# EAGLE design MK12_PIR_LUX (EAGLE 9.0.1)

## Sheet 1 of 2
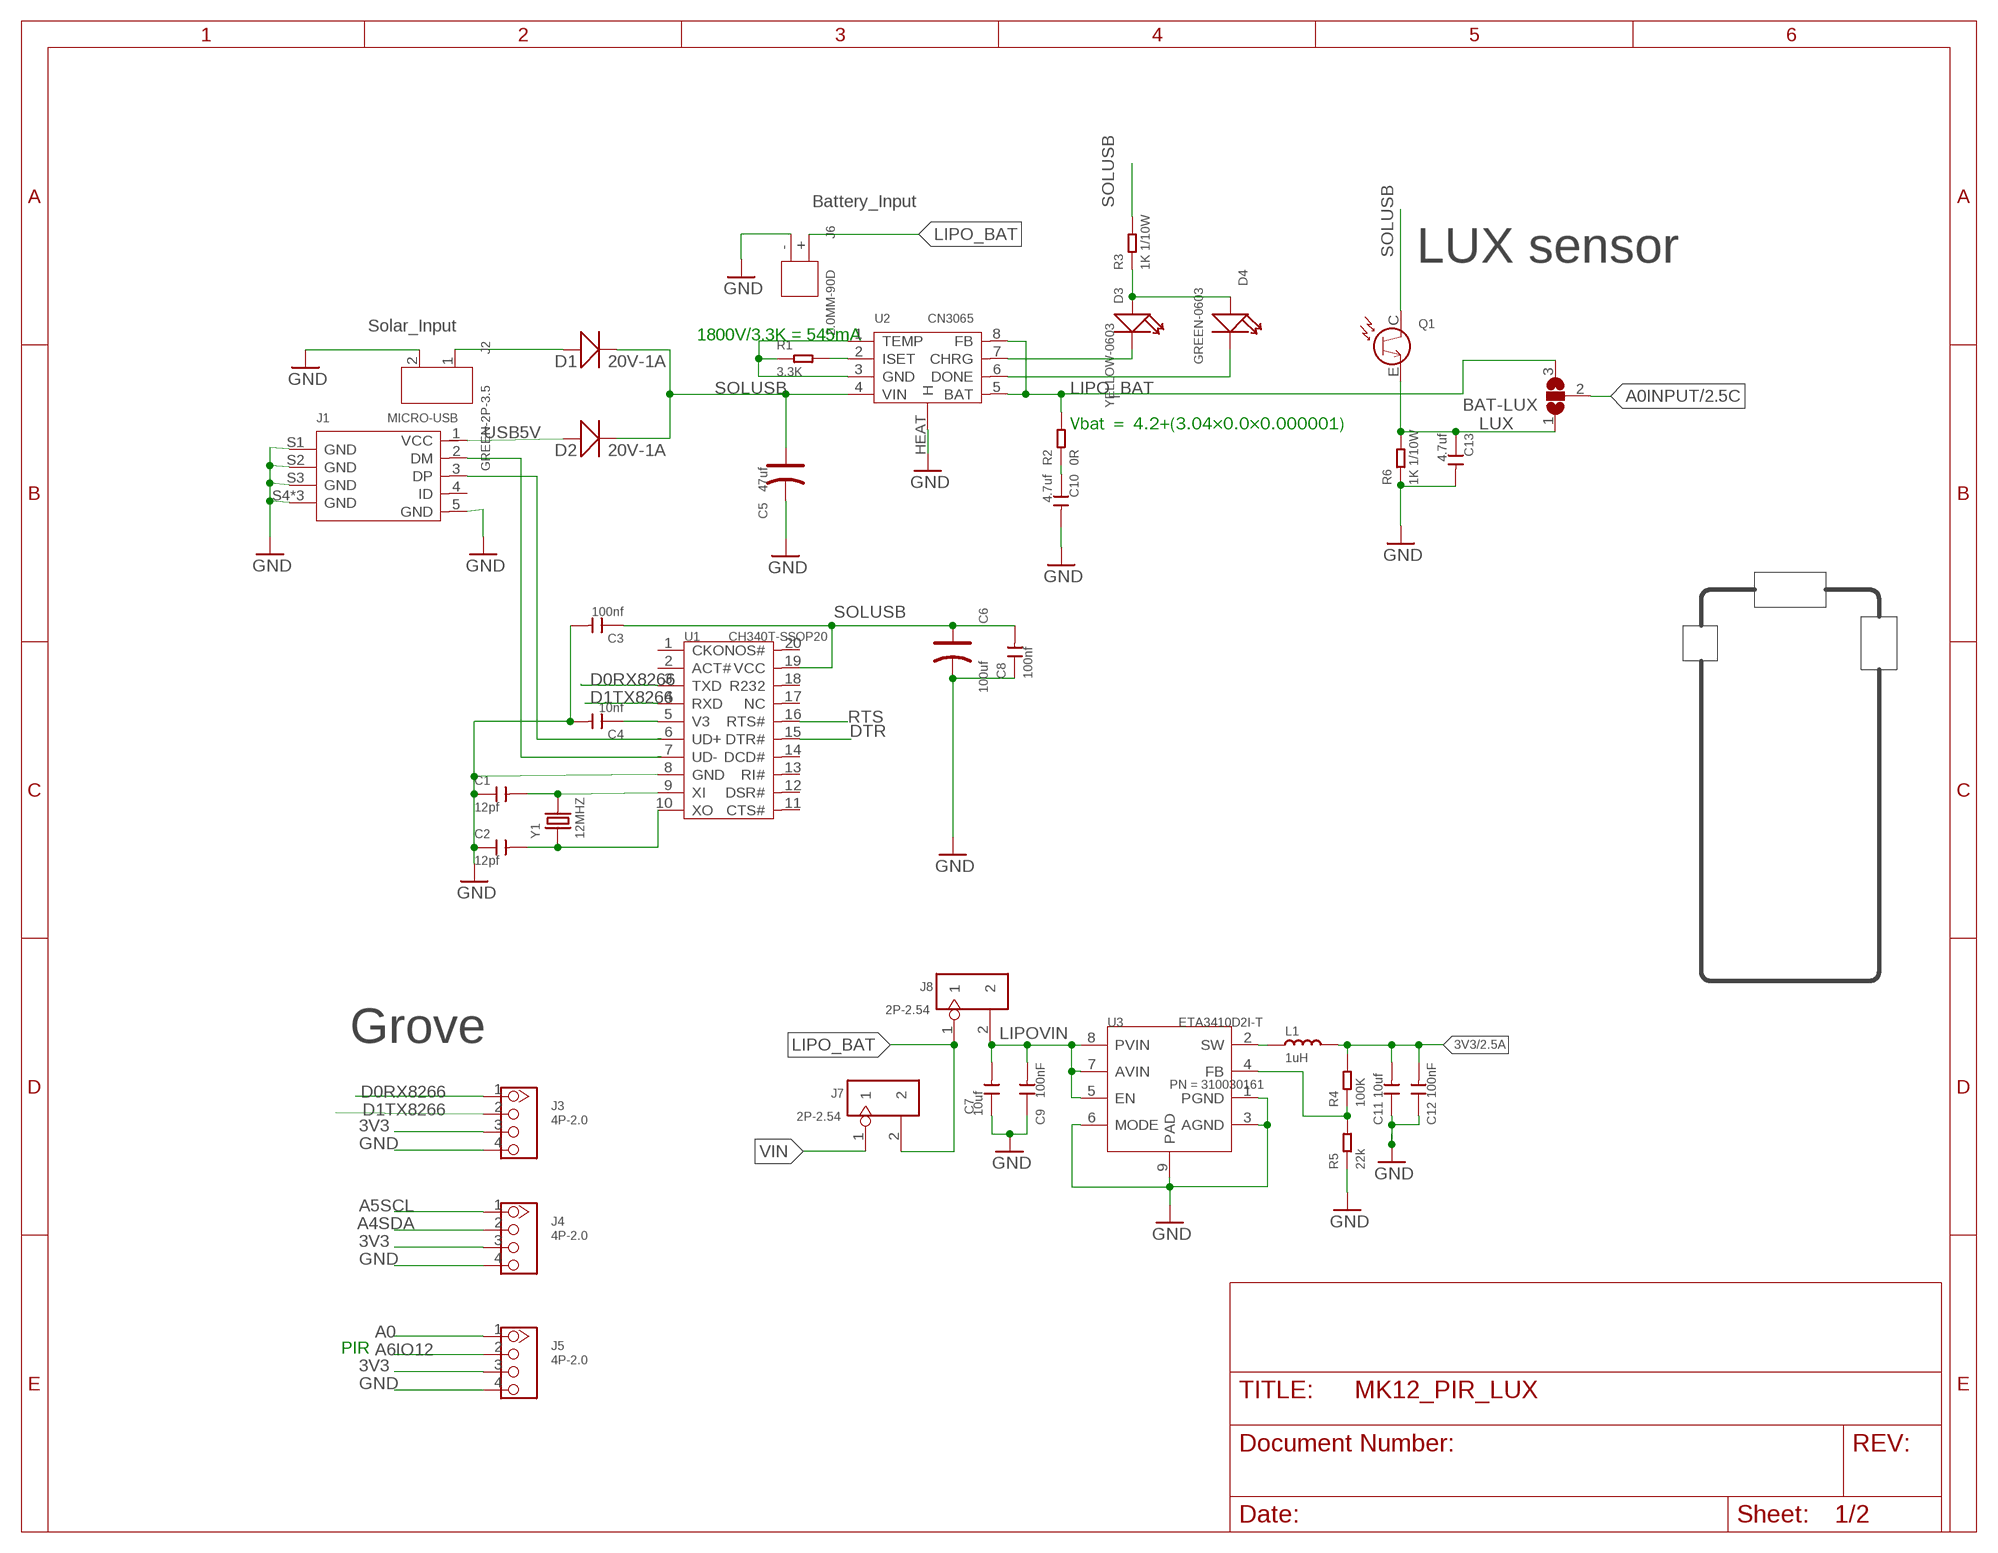
[diagram p0: schematic, sheet 1]

### Parts
BAT-LUX  SJ2W  [SJ_2]
C1  12pf  CERAMIC-12PF-50V-5%-NPO(0402)  [C0402]
C2  12pf  CERAMIC-12PF-50V-5%-NPO(0402)  [C0402]
C3  100nf  CERAMIC-100NF-50V-10%-X7R(0603)  [C0603]
C4  10nf  CERAMIC-10NF-50V-10%-X7R(0603)  [C0603]
C5  47uf  TANTALUM-SMD-47UF-6.3V(AVX-A)  [AVX-A]
C6  100uf  TANTALUM-SMD-100UF-10V(AVX-B)  [AVX-B]
C7  10uf  CERAMIC-10UF-25V-10%-X5R(0805)  [C0805]
C8  100nf  CERAMIC-100NF-50V-10%-X7R(0603)  [C0603]
C9  100nF  CAP-0402  [C0402]
C10  4.7uf  CERAMIC-4.7UF-10V-10%-X5R(0603)  [C0603]
C11  10uf  CERAMIC-10UF-25V-10%-X5R(0805)  [C0805]
C12  100nF  CAP-0402  [C0402]
C13  4.7uf  CERAMIC-4.7UF-10V-10%-X5R(0603)  [C0603]
D1  20V-1A  SMD-DIODE-SCHOTTKY-20V-1A(SOD-123)  [SOD-123]
D2  20V-1A  SMD-DIODE-SCHOTTKY-20V-1A(SOD-123)  [SOD-123]
D3  YELLOW-0603  SMD-LED-CLEAR-YELLOW(0603)  [LED-0603]
D4  GREEN-0603  SMD-LED-CLEAR-GREEN(0603)  [LED-0603]
J1  MICRO-USB  MICRO-USB5+4P'5+4P'  [MICRO-USB5+4P-SMD-0.65-B]
J2  GREEN-2P-3.5  SCREW-TERMINAL-GREEN(2P-3.5)  [H2-3.5-7.0X7.0MM]
J3  4P-2.0  GROVE-CONNECTOR-DIP(4P-2.0)  [HW4-2.0]
J4  4P-2.0  GROVE-CONNECTOR-DIP(4P-2.0)  [HW4-2.0]
J5  4P-2.0  GROVE-CONNECTOR-DIP(4P-2.0)  [HW4-2.0]
J6  2.0MM-90D  CONN-HEADER-PH-SIDE-(2P-2.0MM)'90D'  [H2-2.0-90D]
J7  2P-2.54  DIP-WHITE-MALE-HEADER-VERT(2P-2.54)  [H2-2.54]
J8  2P-2.54  DIP-WHITE-MALE-HEADER-VERT(2P-2.54)  [H2-2.54]
L1  1uH  INDUCTOR/FERRITE-BEAD'0603'  [L0603]
Q1  EAALST05RDMA0  [EAALST05RDMA0]
R1  3.3K  SMD-RES-3.3K-5%-1/10W(0603)  [R0603]
R2  0R  SMD-RES-0R-5%-1/10W(0603)  [R0603]
R3  1K 1/10W  SMD-RES-1K-5%-1/10W(0603)  [R0603]
R4  100K  SMD-RES-100K-1%-1/16W(0402)  [R0402]
R5  22k  SMD-RES-22K-1%-1/16W(0402)  [R0402]
R6  1K 1/10W  SMD-RES-1K-5%-1/10W(0603)  [R0603]
U1  CH340T-SSOP20  INTERFACE-CH340T(SSOP20)  [SSOP20-0.65-7.6X5.2MM]
U2  CN3065  PMIC-CN3065-DFN8  [DFN-8]
U3  ETA3410D2I-T  CONVERTER-ETA3410  [DFN8G-0.5-2X2MM]
Y1  12MHZ  SMD-CRYSTAL-12MHZ-20PF-20PPM-40R(2P-5.0X3.2MM)  [X2-SMD-5.0X3.2X1.3MM]

### Nets
3V3 [POWER]: C11.2 C12.2 J3.3 J4.3 J5.3 L1.2 R4.2 ; also sheet 2
A0: J5.1 ; also sheet 2
A0INPUT [POWER]: BAT-LUX.2 ; also sheet 2
A4SDA: J4.2 ; also sheet 2
A5SCL: J4.1 ; also sheet 2
A6IO12: J5.2 ; also sheet 2
D0RX8266: J3.1 U1.3(TXD) ; also sheet 2
D1TX8266: J3.2 U1.4(RXD) ; also sheet 2
DTR: U1.15(DTR#) ; also sheet 2
GND [POWER]: C1.1 C2.1 C3.2 C4.2 C5.- C6.- C7.1 C8.1 C9.1 C10.2 C11.1 C12.1 C13.2 J1.5(GND) J1.S1(GND) J1.S2(GND) J1.S3(GND) J1.S4(GND) J1.S5(GND) J1.S6(GND) J2.2 J3.4 J4.4 J5.4 J6.- R1.1 R5.1 R6.1 U1.8(GND) U2.1(TEMP) U2.3(GND) U2.HEAT(H) U3.1(PGND) U3.3(AGND) U3.6(MODE) U3.9(PAD) ; also sheet 2
LIPO_BAT [POWER]: BAT-LUX.3 J6.+ J7.2 J8.1 R2.2 U2.5(BAT) U2.8(FB)
LIPOVIN: C7.2 C9.2 J8.2 U3.5(EN) U3.7(AVIN) U3.8(PVIN)
LUX: BAT-LUX.1 C13.1 Q1.E R6.2
N$2: D3.+ D4.+ R3.1
N$3: L1.1 U3.2(SW)
N$4: R4.1 R5.2 U3.4(FB)
N$5 [POWER]: C1.2 U1.9(XI) Y1.2
N$6 [POWER]: C2.2 U1.10(XO) Y1.1
N$7: R1.2 U2.2(ISET)
N$8: D3.- U2.7(CHRG)
N$9: J1.2(DM) U1.7(UD-)
N$10: C10.1 R2.1
N$11: J1.3(DP) U1.6(UD+)
N$12: D4.- U2.6(DONE)
RTS: U1.16(RTS#) ; also sheet 2
SOLAR [VUSB]: D1.+ J2.1
SOLUSB [POWER]: C3.1 C5.+ C6.+ C8.2 D1.- D2.- Q1.C R3.2 U1.19(VCC) U2.4(VIN)
USB5V [VUSB]: D2.+ J1.1(VCC)
V3: C4.1 U1.5(V3)
VIN [POWER]: J7.1 ; also sheet 2
Unconnected: J1.4(ID) U1.1(CKO) U1.2(ACT#) U1.11(CTS#) U1.12(DSR#) U1.13(RI#) U1.14(DCD#) U1.17(NC) U1.18(R232) U1.20(NOS#)

### Notes on the sheet
- Battery_Input
- LUX sensor
- Solar_Input
- 1800V/3.3K = 545mA
- Vbat ＝ 4.2+(3.04×0.0×0.000001)
- Grove
- PIR

## Sheet 2 of 2
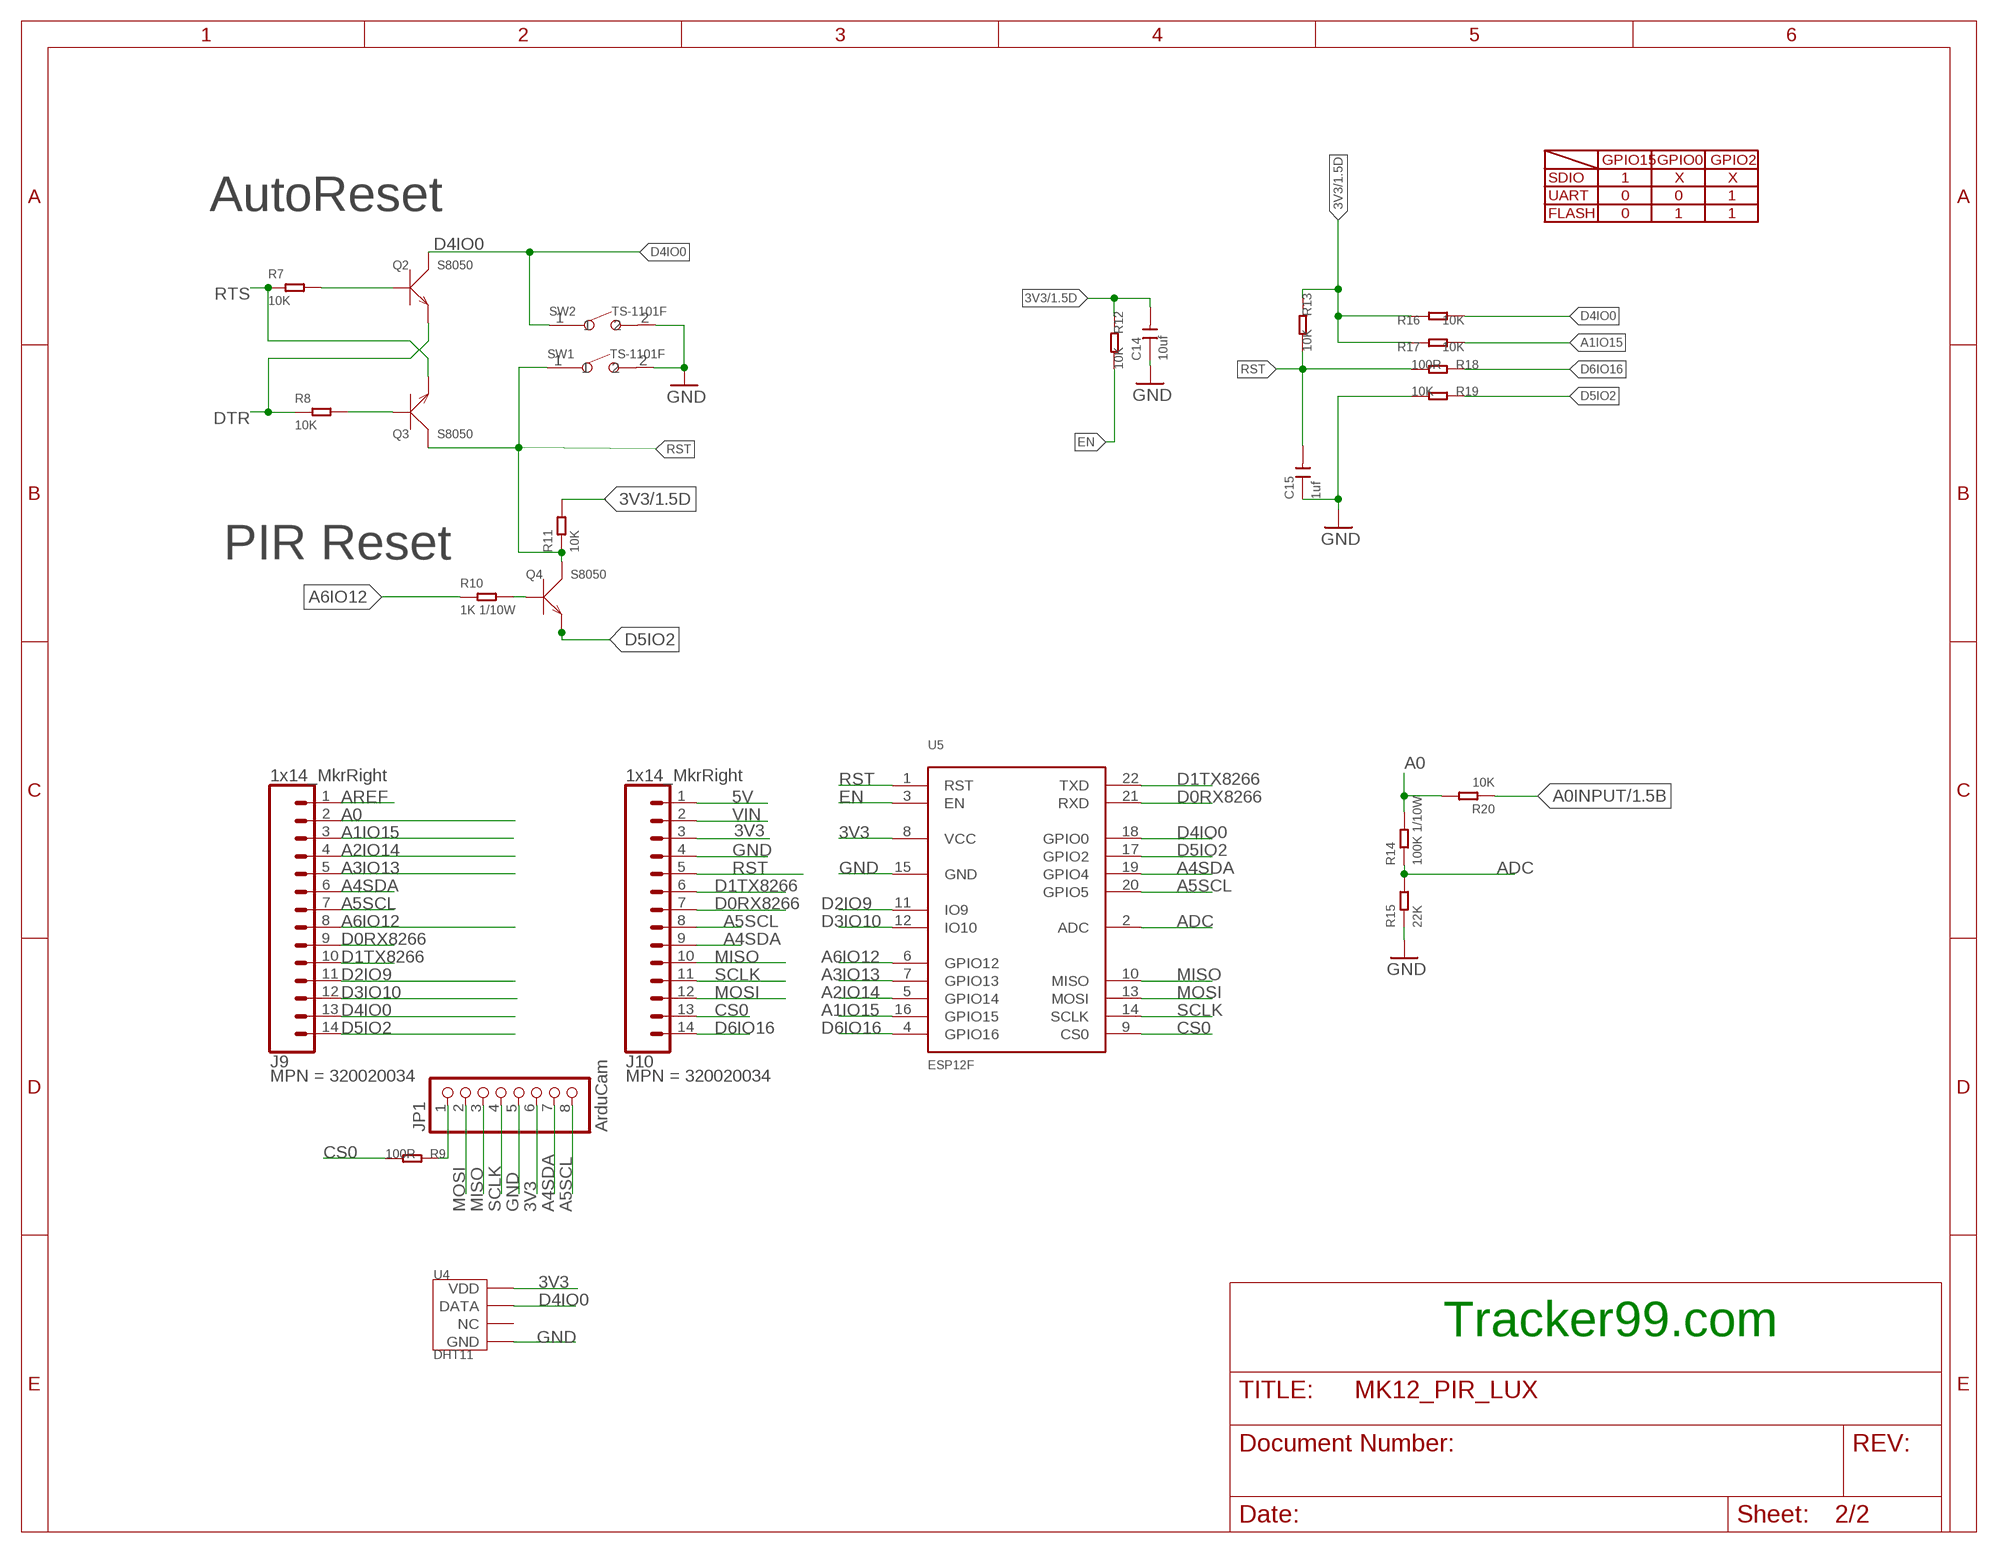
[diagram p1: schematic, sheet 2]

### Parts
C14  10uf  CERAMIC-10UF-10V-10%-X5R(0603)  [C0603]
C15  1uf  CERAMIC-1UF-25V-10%-X7R(0603)  [C0603]
J9  1x14_MkrRight  CONN_14LOCK  [1X14_LOCK]
J10  1x14_MkrRight  CONN_14LOCK  [1X14_LOCK]
JP1  ArduCam  MILLER_PINHD-1X8LOCK  [MILLER_1X08-LOCK]
Q2  S8050  SMD-TRANSISTORS-NPN-25V-500MW-S8050(SOT-23)  [SOT-23]
Q3  S8050  SMD-TRANSISTORS-NPN-25V-500MW-S8050(SOT-23)  [SOT-23]
Q4  S8050  SMD-TRANSISTORS-NPN-25V-500MW-S8050(SOT-23)  [SOT-23]
R7  10K  SMD-RES-10K-5%-1/(0402)  [R0402]
R8  10K  SMD-RES-10K-5%-1/(0402)  [R0402]
R9  100R  SMD-RES-100R-5%-1/10W(0603)  [R0603]
R10  1K 1/10W  SMD-RES-1K-5%-1/10W(0603)  [R0603]
R11  10K  SMD-RES-10K-5%-1/(0402)  [R0402]
R12  10K  SEEED-RESISTOR_SMD-RES-10K-5%-1/(0402)  [SEEED-RESISTOR_R0402]
R13  10K  SEEED-RESISTOR_SMD-RES-10K-5%-1/(0402)  [SEEED-RESISTOR_R0402]
R14  100K 1/10W  SMD-RES-100K-5%-1/10W(0603)  [R0603]
R15  22K  SMD-RES-22K-5%-1/10W(0603)  [R0603]
R16  10K  SEEED-RESISTOR_SMD-RES-10K-5%-1/(0402)  [SEEED-RESISTOR_R0402]
R17  10K  SEEED-RESISTOR_SMD-RES-10K-5%-1/(0402)  [SEEED-RESISTOR_R0402]
R18  100R  SMD-RES-100R-5%-1/10W(0603)  [R0603]
R19  10K  SEEED-RESISTOR_SMD-RES-10K-5%-1/(0402)  [SEEED-RESISTOR_R0402]
R20  10K  SMD-RES-10K-5%-1/(0402)  [R0402]
SW1  TS-1101F  DIP-BUTTON(2P-6.0X3.0X4.3MM)-TS-1101F  [SW2-5.0-6.0X3.0X4.3MM]
SW2  TS-1101F  DIP-BUTTON(2P-6.0X3.0X4.3MM)-TS-1101F  [SW2-5.0-6.0X3.0X4.3MM]
U4  DHT11  TEM-HUM-DHT11(4P-15.5X12.0MM)  [SNR4-2.54-15.5X12.0X5.5MM]
U5  ESP12F  ESP-12F  [ESP-12F]

### Nets
3V3 [POWER]: C14.2 J10.3 JP1.6 R11.2 R12.1 R13.1 R16.1 R17.1 U4.1(VDD) U5.8(VCC) ; also sheet 1
5V [POWER]: J10.1
A0: J9.2 R14.2 R20.2 ; also sheet 1
A0INPUT [POWER]: R20.1 ; also sheet 1
A1IO15: J9.3 R17.2 U5.16(GPIO15)
A2IO14: J9.4 U5.5(GPIO14)
A3IO13: J9.5 U5.7(GPIO13)
A4SDA: J9.6 J10.9 JP1.7 U5.19(GPIO4) ; also sheet 1
A5SCL: J9.7 J10.8 JP1.8 U5.20(GPIO5) ; also sheet 1
A6IO12: J9.8 R10.1 U5.6(GPIO12) ; also sheet 1
ADC: R14.1 R15.2 U5.2(ADC)
AREF: J9.1
CS0: J10.13 R9.2 U5.9(CS0)
D0RX8266: J9.9 J10.7 U5.21(RXD) ; also sheet 1
D1TX8266: J9.10 J10.6 U5.22(TXD) ; also sheet 1
D2IO9: J9.11 U5.11(IO9)
D3IO10: J9.12 U5.12(IO10)
D4IO0: J9.13 Q2.3(C) R16.2 SW2.1 U4.2(DATA) U5.18(GPIO0)
D5IO2: J9.14 Q4.2(E) R19.1 U5.17(GPIO2)
D6IO16: J10.14 R18.1 U5.4(GPIO16)
DTR: Q2.2(E) R8.1 ; also sheet 1
EN: R12.2 U5.3(EN)
GND [POWER]: C14.1 C15.1 J10.4 JP1.5 R15.1 R19.2 SW1.2 SW2.2 U4.4(GND) U5.15(GND) ; also sheet 1
MISO: J10.10 JP1.3 U5.10(MISO)
MOSI: J10.12 JP1.2 U5.13(MOSI)
N$1: Q4.1(B) R10.2
N$13: JP1.1 R9.1
N$14: Q3.1(B) R8.2
N$15: Q2.1(B) R7.2
N$20: Q4.3(C) R11.1
RST: C15.2 J10.5 Q3.3(C) R13.2 R18.2 SW1.1 U5.1(RST)
RTS: Q3.2(E) R7.1 ; also sheet 1
SCLK: J10.11 JP1.4 U5.14(SCLK)
VIN [POWER]: J10.2 ; also sheet 1
Unconnected: U4.3(NC)

### Notes on the sheet
- GPIO15 | GPIO0 | GPIO2
- SDIO | 1 | X | X
- UART | 0 | 0 | 1
- AutoReset
- FLASH | 0 | 1 | 1
- PIR Reset
- Tracker99.com

## Library data of the parts
BAT-LUX = jumper:SJ2W: SMD solder JUMPER
C1 C2 = Seeed-Capacitor:CERAMIC-12PF-50V-5%-NPO(0402): 302010049; MPN: CC0402JRNPO9BN120
C3 C8 = Seeed-Capacitor:CERAMIC-100NF-50V-10%-X7R(0603): 302010138; MPN: CC0603KRX7R9BB104
C4 = Seeed-Capacitor:CERAMIC-10NF-50V-10%-X7R(0603): 302010140; MPN: CC0603KRX7R9BB103
C5 = Seeed-Capacitor:TANTALUM-SMD-47UF-6.3V(AVX-A): 302020005; MPN: TAJA476*006#NJ
C6 = Seeed-Capacitor:TANTALUM-SMD-100UF-10V(AVX-B): 302020015; MPN: TAJB107M010#NJ
C7 C11 = Seeed-Capacitor:CERAMIC-10UF-25V-10%-X5R(0805): 302010178; MPN: CC0805KKX5R8BB106; PN: 302010178
C9 C12 = Discrete-new:CAP: Ceramic Capacitors; PN: 302010004
C10 C13 = Seeed-Capacitor:CERAMIC-4.7UF-10V-10%-X5R(0603): 302010111; MPN: CC0603KRX5R6BB475
C14 = Seeed-Capacitor:CERAMIC-10UF-10V-10%-X5R(0603): 302010103; MPN: CC0603KRX5R6BB106
C15 = Seeed-Capacitor:CERAMIC-1UF-25V-10%-X7R(0603): 302010139; MPN: CC0603KRX7R8BB105
D1 D2 = Seeed-OPL-2017-01-Diode-james:SMD-DIODE-SCHOTTKY-20V-1A(SOD-123): 304020034; MPN: B5819W
D3 = Seeed-LED:SMD-LED-CLEAR-YELLOW(0603): 304090044; MPN: 19-217-Y5C-AM1N1VY-3T
D4 = Seeed-LED:SMD-LED-CLEAR-GREEN(0603): 304090043; MPN: 19-217-G7C-AN1P2-3T
J1 = Connector-new:MICRO-USB5+4P: 5+4P-SMD-0.65-B:320010000;5+2P-SMD-0.65-AB:340032001; EAGLEUP: USB-MICROB;2.54mm
J2 = Seeed-Connector:SCREW-TERMINAL-GREEN(2P-3.5): 320110028
J3-J5 = Seeed-Connector:GROVE-CONNECTOR-DIP(4P-2.0): 320110033
J6 = Seeed-Connector:CONN-HEADER-PH-SIDE-(2P-2.0MM): 320110027
J7 J8 = Seeed-Connector:DIP-WHITE-MALE-HEADER-VERT(2P-2.54): 320020037; MPN: P125-1102A0BS116A3
J9 J10 = SparkFun-Connectors:CONN_14: Multi connection point. Often used as Generic Header-pin footprint for 0.1 inch spaced/style header connections On any of the 0.1 inch spaced packages, you can populate with these: Break Away Headers - Straight <https://www.sparkfun.com/products/116> (PRT-00116) Break Away Male Headers - Right Angle <https://www.sparkfun.com/products/553> (PRT-00553) Female Headers <https://www.sparkfun.com/products/115> (PRT-00115) Break Away Headers - Machine Pin <https://www.sparkfun.com/products/117> (PRT-00117) Break Away Female Headers - Swiss Machine Pin <https://www.sparkfun.com/products/743> (PRT-00743) For SCREWTERMINALS and SPRING TERMINALS visit here: Screw Terimnals on SparkFun.com <https://www.sparkfun.com/search/results?term=Screw+Terminals> (5mm/3.5mm/2.54mm spacing) This device is also useful as a general connection point to wire up your design to another part of your project. Our various solder wires solder well into these plated through hole pads. Hook-Up Wire - Assortment (Stranded, 22 AWG) <https://www.sparkfun.com/products/11375> (PRT-11375) Hook-Up Wire - Assortment (Solid Core, 22 AWG) <https://www.sparkfun.com/products/11367> (PRT-11367) View the entire wire category on our website here <https://www.sparkfun.com/categories/141> Special notes: Molex polarized connector foot print use with SKU : PRT-08231 with associated crimp pins and housings. 1MM SMD Version SKU: PRT-10208 NOTES ON THE VARIANTS LOCK and LOCK_LONGPADS... This footprint was designed to help hold the alignment of a through-hole component (i.e. 6-pin header) while soldering it into place. You may notice that each hole has been shifted either up or down by 0.005 of an inch from it's more standard position (which is a perfectly straight line). This slight alteration caused the pins (the squares in the middle) to touch the edges of the holes. Because they are alternating, it causes a "brace" to hold the component in place. 0.005 has proven to be the perfect amount of "off-center" position when using our standard breakaway headers. Although looks a little odd when you look at the bare footprint, once you have a header in there, the alteration is very hard to notice. Also,if you push a header all the way into place, it is covered up entirely on the bottom side.; MPN: 320020034
JP1 = MKR12FUNO99:MILLER_PINHD-1X8: PIN HEADER
L1 = Discrete-new:INDUCTOR/FERRITE-BEAD; PN: 303010110
Q1 = Seeed-OPL-2017-01-Sensor-camilo:EAALST05RDMA0: 314020201
Q2-Q4 = Seeed-Transistor:SMD-TRANSISTORS-NPN-25V-500MW-S8050(SOT-23): 305010017; MPN: S8050
R1 = Seeed-Resistor:SMD-RES-3.3K-5%-1/10W(0603): 301010112
R2 = Seeed-Resistor:SMD-RES-0R-5%-1/10W(0603): 301010292; MPN: RC0603JR-070RL
R3 R6 R10 = Seeed-Resistor:SMD-RES-1K-5%-1/10W(0603): 301010291; MPN: RC0603JR-071KL
R4 = Seeed-Resistor:SMD-RES-100K-1%-1/16W(0402): 301010456; MPN: RC0402FR-07100KL; PN: 301010666
R5 = Seeed-Resistor:SMD-RES-22K-1%-1/16W(0402); MPN: RC0402FR-0722KL
R7 R8 R11 R20 = Seeed-Resistor:SMD-RES-10K-5%-1/(0402): 301010004; MPN: RC0402JR-0710KL
R9 R18 = Seeed-Resistor:SMD-RES-100R-5%-1/10W(0603): 301010090; MPN: RC0603JR-07100RL
R12 R13 R16 R17 R19 = R3Mkr12F_Solar:SEEED-RESISTOR_SMD-RES-10K-5%-1/(0402): 301010004; MPN: RC0402JR-0710KL
R14 = Seeed-Resistor:SMD-RES-100K-5%-1/10W(0603): 301010089; MPN: RC0603JR-07100KL; PN: 301010666
R15 = Seeed-Resistor:SMD-RES-22K-5%-1/10W(0603): 301010132; MPN: RC0603JR-0722KL
SW1 SW2 = Seeed-Switch:DIP-BUTTON(2P-6.0X3.0X4.3MM): 311020025; MPN: TS-1101F
U1 = Seeed-IC:INTERFACE-CH340T(SSOP20): 310070026; MPN: CH340T
U2 = IC-new:PMIC-CN3065: 310030101
U3 = template:CONVERTER-ETA3410: 3MHZ 2A High Step-Down Converter in DFN2x2-8L Package; PN: 310030161
U4 = Seeed-Sensor:TEM-HUM-DHT11(4P-15.5X12.0MM): 314010000; MPN: DHT11
U5 = Seeed-OPL-2017-01-Sensor-camilo:ESP-12F: 317060163
Y1 = Seeed-Crystal Oscillator:SMD-CRYSTAL-12MHZ-20PF-20PPM-40R(2P-5.0X3.2MM): 306010047; MPN: 5032/2P

## Net classes
0 default: width 0.152 mm, drill 0.152 mm, clearance 0.152 mm
1 POWER: width 0.305 mm, clearance 0.152 mm
2 VUSB: width 0.305 mm, clearance 0.203 mm

## Board
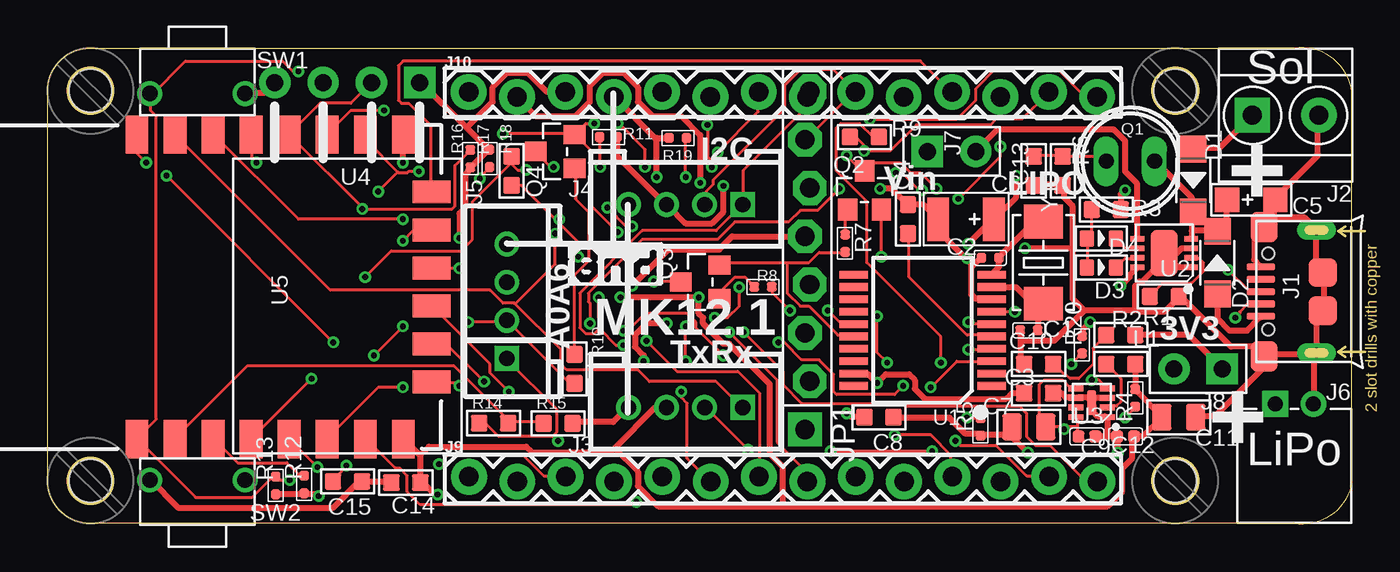
[diagram p2: board, top side]
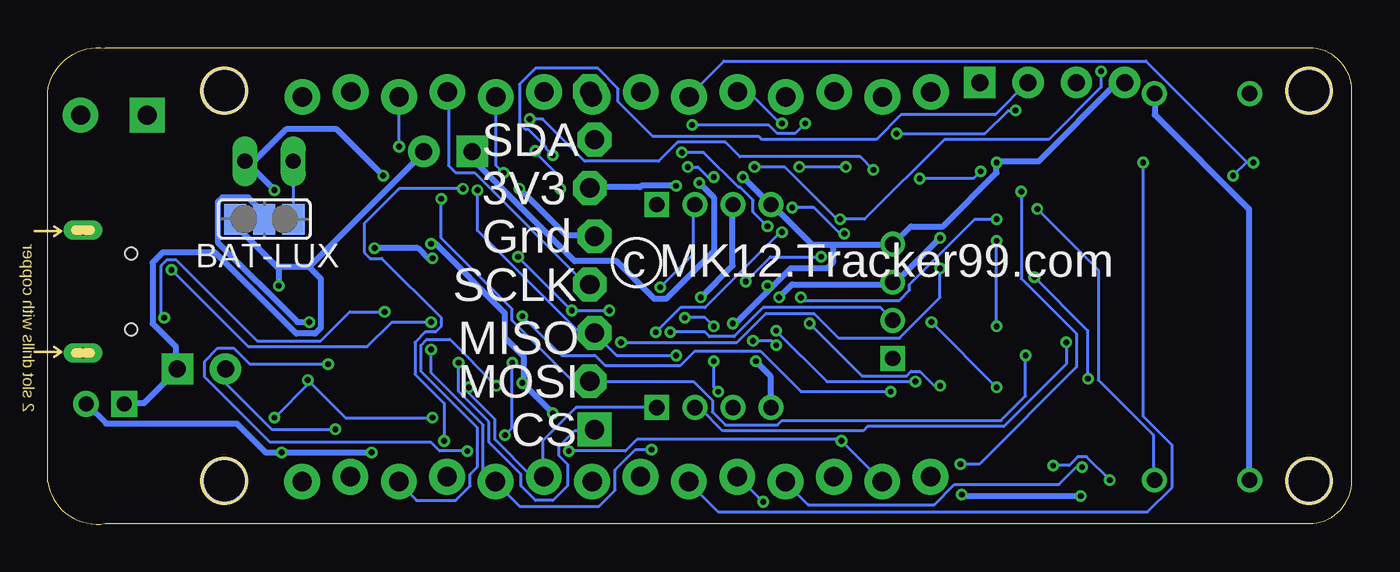
[diagram p3: board, bottom side, seen from below]

Size 68.54 x 25.05 mm. Coordinates in mm from the lower left corner, seen from the top.
Outline: 0,2.28 0,22.78 arc-90 2.25,25.03 65.5,25.03 arc-90 68.54,22.73 68.54,2.23 arc-90 65.5,0.03 2.25,0.03 arc-90 0,2.28
Copper layers (1*16): Top 0.035mm / dielectric 1.5mm / Bottom 0.035mm
Design rules "SeeedStudio_2layer_DRU_no_angle_20140221 *": minimum track width 6mil, minimum drill 12mil, track to track 6mil, track to pad 6mil, pad to pad 6mil, via to via 6mil, smd to smd 0mil, copper to edge 10mil, drill to drill 10mil, minimum pad ring 10mil, minimum via ring 6mil, stop-mask expansion 2mil, vias tented up to drill 100mil, thermal gap 10mil
Holes 2.25 mm at 2.25,2.28 59.25,2.28 59.25,22.78 2.25,22.78
tRestrict: area 0,0.1 to 4.5,4.5; area 0,20.6 to 4.5,25; area 57,20.6 to 61.5,25; area 57,0.1 to 61.5,4.5; area 0,4.4 to 4.1,20.4; area 10.7,24.4 to 57.9,25.4; area 10.2,-0.5 to 57.4,0.5; 26 lines
bRestrict: area 0,0.1 to 4.5,4.5; area 0,20.6 to 4.5,25; area 57,0.1 to 61.5,4.5; area 57,20.6 to 61.5,25; area 0,4.4 to 4.1,20.4; area 10.7,24.4 to 57.9,25.4; area 10.7,-0.5 to 57.4,0.5; 25 lines

### Footprints (pad centres in the part's own frame; a part is rotated, then mirrored left to right if it is on the bottom)
SJ_2 = smd 1.168 x 1.6: 1 -1.524,0; 2 0,0; 3 1.524,0
C0402 = smd 0.5 x 0.5: 1 0,0.463; 2 0,-0.463
C0603 = smd 0.889 x 0.889: 1 0,0.762; 2 0,-0.762
AVX-A = smd 1.27 x 1.27: + -1.27,0; - 1.27,0
AVX-B = smd 1.143 x 2.286: + -1.46,0; - 1.46,0
C0805 = smd 1.397 x 1.016: 1 0,0.889; 2 0,-0.889
C0402' = smd 0.635 x 0.635: 1 0,0.445; 2 0,-0.445
SOD-123 = smd 1.397 x 1.397: + -1.651,0; - 1.651,0
LED-0603 = smd 0.762 x 0.889: + -0.762,0; - 0.762,0
MICRO-USB5+4P-SMD-0.65-B = smd 0.381 x 1.524: 1 -1.3,-0.25; 2 -0.65,-0.25; 3 0,-0.25; 4 0.65,-0.25; 5 1.3,-0.25 | smd 1.6 x 1.397: S1 -3.4,-0.427; S6 3.4,-0.427 | drill 0.508 pad 1.016 long: S2 -3.226,-3.175; S5 3.226,-3.175 | smd 1.5 x 1.5: S3 -1,-3.5; S4 1,-3.5 | hole 0.635: -2,-0.65; 2,-0.65
H2-3.5-7.0X7.0MM = drill 1 pad 1.85 square: 1 -1.75,0 | drill 1 pad 1.85: 2 1.75,0
HW4-2.0 = drill 0.8 pad 1.27 square: 1 -3,0 | drill 0.8 pad 1.27: 2 -1,0; 3 1,0; 4 3,0
H2-2.0-90D = drill 0.8 pad 1.35 square: + -1,3.25 | drill 0.8 pad 1.35: - 1,3.25
H2-2.54 = drill 0.889 pad 1.651 square: 1 0,1.27 | drill 0.889 pad 1.651: 2 0,-1.27
1X14_LOCK = drill 1.016 pad 1.88: 1 0,0.127; 2 2.54,-0.127; 3 5.08,0.127; 4 7.62,-0.127; 5 10.16,0.127; 6 12.7,-0.127; 7 15.24,0.127; 8 17.78,-0.127; 9 20.32,0.127; 10 22.86,-0.127; 11 25.4,0.127; 12 27.94,-0.127; 13 30.48,0.127; 14 33.02,-0.127
MILLER_1X08-LOCK = drill 1.016 pad 1.778 square: 1 -8.89,0.127 | drill 1.016 pad 1.778 octagon: 2 -6.35,-0.127; 3 -3.81,0.127; 4 -1.27,-0.127; 5 1.27,0.127; 6 3.81,-0.127; 7 6.35,0.127; 8 8.89,-0.127
L0603 = smd 0.889 x 0.889: 1 -0.762,0; 2 0.762,0
EAALST05RDMA0 = drill 0.8 long: C 1.27,0; E -1.27,0
SOT-23 = smd 1.016 x 1.143: 1 -0.889,-1.016; 2 0.889,-1.016; 3 0,1.016
R0603 = smd 0.889 x 0.889: 1 0,0.762; 2 0,-0.762
R0402 = smd 0.5 x 0.5: 1 0,0.463; 2 0,-0.463
SEEED-RESISTOR_R0402 = smd 0.5 x 0.5: 1 0,0.463; 2 0,-0.463
SW2-5.0-6.0X3.0X4.3MM = drill 0.8 pad 1.27: 1 -2.5,0; 2 2.5,0
SSOP20-0.65-7.6X5.2MM = smd 0.4 x 1.5: 1 -2.925,-3.625; 2 -2.275,-3.625; 3 -1.625,-3.625; 4 -0.975,-3.625; 5 -0.325,-3.625; 6 0.325,-3.625; 7 0.975,-3.625; 8 1.625,-3.625; 9 2.275,-3.625; 10 2.925,-3.625; 11 2.925,3.625; 12 2.275,3.625; 13 1.625,3.625; 14 0.975,3.625; 15 0.325,3.625; 16 -0.325,3.625; 17 -0.975,3.625; 18 -1.625,3.625; 19 -2.275,3.625; 20 -2.925,3.625
DFN-8 = smd 0.3 x 0.727: 1 -0.75,-1.413; 2 -0.25,-1.413; 3 0.25,-1.413; 4 0.75,-1.413; 5 0.75,1.413; 6 0.25,1.413; 7 -0.25,1.413; 8 -0.75,1.413 | smd 2.413 x 1.397: HEAT 0,0
DFN8G-0.5-2X2MM = smd 0.8 x 0.3: 1 -0.827,0.75; 2 -0.827,0.25; 3 -0.827,-0.25; 4 -0.827,-0.75; 5 0.827,-0.75; 6 0.827,-0.25; 7 0.827,0.25; 8 0.827,0.75 | smd 0.45 x 1.3: 9 0,0
SNR4-2.54-15.5X12.0X5.5MM = drill 0.889 pad 1.651 square: 1 -11.75,3.81 | drill 0.889 pad 1.651: 2 -11.75,1.27; 3 -11.75,-1.27; 4 -11.75,-3.81
ESP-12F = smd 2 x 1.2: 1 -8,3.48; 2 -8,1.48; 3 -8,-0.52; 4 -8,-2.52; 5 -8,-4.52; 6 -8,-6.52; 7 -8,-8.52; 8 -8,-10.52; 15 8,-10.52; 16 8,-8.52; 17 8,-6.52; 18 8,-4.52; 19 8,-2.52; 20 8,-0.52; 21 8,1.48; 22 8,3.48 | smd 1.2 x 2: 9 -5,-12; 10 -3,-12; 11 -1,-12; 12 1,-12; 13 3,-12; 14 5,-12
X2-SMD-5.0X3.2X1.3MM = smd 1.778 x 2.032: 1 -2.159,0; 2 2.159,0

### Placement (x,y rotation side)
BAT-LUX  57.15,16.03 180 bottom
C1  51.56,10.19 90 top
C2  49.53,14 90 top
C3  52.07,6.89 90 top
C4  45.21,16.03 180 top
C5  63.25,17.05 0 top
C6  48.26,16.03 180 top
C7  51.56,5.11 90 top
C8  43.69,5.62 270 top
C9  100nF  [C0402']  54.61,4.6 270 top
C10  52.07,8.41 270 top
C11  59.44,5.62 270 top
C12  100nF  [C0402']  56.64,4.6 90 top
C13  51.82,18.57 0 top
C14  18.83,2.19 90 top
C15  15.76,2.24 270 top
D1  60.2,18.07 270 top
D2  61.47,13.75 90 top
D3  55.37,13.49 0 top
D4  55.37,15.02 0 top
J1  63.5,12.22 90 top
J2  65.05,21.5 0 top
J3  33.53,6.13 180 top
J4  33.53,16.8 180 top
J5  24.13,11.72 90 top
J6  65.51,3.07 0 top
J7  47.5,19.59 90 top
J8  60.45,8.16 270 top
J9  22.14,2.37 0 top
J10  22.13,22.59 0 top
JP1  39.92,13.86 90 top
L1  56.39,8.41 0 top
Q1  56.9,19.08 0 top
Q2  42.93,17.56 0 top
Q3  34.29,12.73 90 top
Q4  26.67,19.59 90 top
R1  58.67,11.97 270 top
R2  56.39,9.94 90 top
R3  55.63,16.54 90 top
R4  57.15,6.64 180 top
R5  49.02,5.11 180 top
R6  53.34,18.57 180 top
R7  41.91,14.76 180 top
R8  37.59,12.48 270 top
R9  42.93,20.35 270 top
R10  27.69,8.16 180 top
R11  29.46,20.35 90 top
R12  13.49,2.09 180 top
R13  11.99,2.03 180 top
R14  23.44,5.31 270 top
R15  26.82,5.29 270 top
R16  22.21,19.22 180 top
R17  23.22,19.23 0 top
R18  24.38,18.57 0 top
R19  33.11,20.3 270 top
R20  54.36,9.43 0 top
SW1  7.87,22.64 0 top
SW2  7.87,2.32 180 top
U1  45.97,10.19 90 top
U2  58.67,14.26 90 top
U3  54.86,6.38 180 top
U4  15.75,11.46 270 top
U5  8.18,12.47 90 top
U$5  [MH_RND_F_2.2MM_NM]  2.25,2.28 90 top
U$6  [MH_RND_F_2.2MM_NM]  2.25,22.78 90 top
U$7  [MH_RND_F_2.2MM_NM]  59.25,22.78 90 top
U$8  [MH_RND_F_2.2MM_NM]  59.25,2.28 90 top
Y1  52.32,13.75 270 top

### Tracks (layer width: path | path; a pad name or v marks a point on that pad's centre or on a via)
3V3  (via drill 0.3)
  Top 0.305: 22.02,20.84 19.58,23.27 U4.1 | 22.02,20.84 23.09,19.77 R17.1 23.16,19.69 22.25,18.78 R16.1 22.17,18.63 21.95,18.4 21.95,16.64 21.64,16.34 v21.64,15.04 | 22.02,20.84 23.39,22.21 23.39,22.97 24.16,23.73 25.22,23.73 26.21,22.74 27.2,22.74 J10.3 | R11.2 29.95,20.3 29.95,19.31 32.46,16.8 J4.3 32.61,16.72 33.53,15.81 34.9,15.81 35.51,16.42 v35.51,17.79 | L1.2 R4.2 57.23,6.97 58.52,5.67 C11.2 57.53,4.6 C12.2 57,4.53 57,3.46 56.46,2.93 56.46,1.71 55.7,0.95 38.63,0.95 | R13.1 12.04,1.56 13.41,1.56 R12.1 13.56,1.56 14.17,1.56 v14.25,1.48 | 19.58,3.61 19.58,2.24 C14.2 19.74,2.17 20.34,1.56 v20.5,1.56 | 19.58,3.61 18.75,4.45 U5.8 | J3.3 31.93,6.13 29.79,3.99 | 29.79,3.99 29.57,3.77 25.45,3.77 25.15,4.07 20.04,4.07 19.58,3.61 | 38.63,0.95 32.08,0.95 31.01,2.01 31.01,2.78 29.79,3.99 | 38.63,0.95 38.63,3 37.95,3.69 37.95,7.35 35.81,9.48 35.51,9.48 34.44,10.55 34.44,10.85 34.21,11.08 v34.21,11.92 v30.1,11.92
  Bottom 0.305: v21.64,15.04 23.93,12.76 24.08,12.76 J5.3 24.23,12.61 29.41,12.61 v30.1,11.92 | v35.51,17.79 37.34,17.79 37.41,17.71 40.01,17.71 JP1.6 | v14.25,1.48 20.42,1.48 v20.5,1.56 | v34.21,11.92 32.54,13.6 J4.3
A0  (via drill 0.3)
  Top 0.152: 26.56,4.64 26.75,4.83 26.75,6.05 24.16,8.64 J5.1 | 26.56,4.64 26.52,4.6 23.7,4.6 23.01,5.29 22.71,5.29 R14.2 | v53.8,8.41 54.33,8.95 R20.2 | v41.15,3.84 v46.48,3.84 | v26.82,4.38 26.56,4.64
  Bottom 0.152: v53.8,8.41 57.91,8.41 58.75,9.25 59.59,9.25 60.27,8.57 60.27,7.73 56.84,4.3 48.39,4.3 47.93,3.84 v46.48,3.84 | v41.15,3.84 38.18,3.84 37.57,4.45 26.9,4.45 v26.82,4.38 J9.2
A0INPUT  (via drill 0.3)
  Top 0.305: v54.79,10.62 54.41,10.24 54.41,9.94 R20.1
  Bottom 0.305: v54.79,10.62 55.4,10.62 59.59,14.82 59.59,16.95 59.36,17.18 57.99,17.18 57.15,16.34 BAT-LUX.2
A1IO15  (via drill 0.3)
  Top 0.152: v22.71,18.17 22.71,18.24 23.16,18.7 R17.2 | v19.51,18.55 18.97,18.55 18.9,18.47 18.44,18.47 18.4,18.51 | 18.4,18.51 16.76,20.15 16.76,20.45 U5.16 | v20.57,3.16 21.11,3.69 24.92,3.69 26.06,2.55 27.2,2.55 J9.3 | 18.4,18.51 v17.37,17.48
  Bottom 0.152: v22.71,18.17 19.89,18.17 v19.51,18.55 | v20.57,3.16 19.58,3.16 14.48,8.26 14.48,10.01 17.37,12.91 v17.37,17.48
A2IO14  (via drill 0.3)
  Top 0.152: v14.17,3 12.72,4.45 U5.5
  Bottom 0.152: v14.17,3 14.48,3 15.39,2.09 20.88,2.09 21.95,1.02 28.57,1.02 29.72,2.17 J9.4
A3IO13  (via drill 0.3)
  Top 0.152: v30.94,1.18 30.79,1.02 19.58,1.02 18.9,1.71 18.9,2.55 18.52,2.93 18.29,2.93 16.76,4.45 U5.7
  Bottom 0.152: v30.94,1.18 32.23,2.47 J9.5
A4SDA  (via drill 0.3)
  Top 0.152: J4.2 34.59,16.8 34.59,17.48 34.98,17.86 34.98,18.09 38.71,21.83 38.71,23.04 39.55,23.88 41.3,23.88 42.44,22.74 J10.9 42.37,22.74 39.85,20.23 JP1.7 | v10.97,19.01 10.74,19.23 10.74,20.45 U5.19 | v36.35,12.45 36.35,11.46 35.74,10.85 v35.05,10.85 | v33.53,8.57 v33.53,10.4 | v33.3,6.97 33.3,6.66 33.6,6.36 33.6,3.46 34.82,2.24 J9.6
  Bottom 0.152: v10.97,19.01 10.97,5.67 9.45,4.15 9.45,1.94 10.74,0.64 33.3,0.64 34.82,2.17 J9.6 | v36.35,12.45 34.59,14.21 34.59,16.8 J4.2 | v35.05,10.85 33.98,10.85 v33.53,10.4 | v33.53,8.57 33.53,7.2 v33.3,6.97
A5SCL  (via drill 0.3)
  Top 0.152: J10.8 39.93,22.51 40.01,22.59 40.01,22.74 JP1.8 39.85,22.44 39.85,21.9 36.58,18.63 36.58,16.8 J4.1 36.5,16.8 35.13,15.42 31.24,15.42 27.96,12.15 27.96,10.32 28.27,10.01 28.73,10.01 28.99,10.28 | v18.67,16.03 13.18,16.03 8.76,20.45 U5.20 | v28.96,11.92 28.96,10.85 29.03,10.78 29.03,10.32 28.99,10.28 | v31.47,9.63 33.07,8.03 36.27,8.03 37.41,6.89 37.41,2.55 J9.7 | v30.25,9.41 29.87,9.41 28.99,10.28
  Bottom 0.152: v18.67,16.03 19.81,16.03 23.24,12.61 23.24,12.3 23.77,11.77 28.8,11.77 v28.96,11.92 | v31.47,9.63 30.48,9.63 v30.25,9.41
A6IO12  (via drill 0.3)
  Top 0.152: R10.1 27.66,7.42 27.43,7.42 24.16,10.7 J5.2 24.16,10.62 v22.1,10.62 | v18.67,7.2 17.37,7.2 14.71,4.53 U5.6 | v35.81,10.09 38.33,7.58 38.33,4.3 39.85,2.78 39.85,2.24 J9.8
  Bottom 0.152: v22.1,10.62 v18.67,7.2 | v35.81,10.09 33.98,10.09 33.76,9.86 32.46,9.86 30.94,11.39 24.77,11.39 24.16,10.78 J5.2
ADC
  Top 0.152: R15.2 25.98,5.37 24.23,5.37 R14.1 24.23,5.44 21.34,8.34 10.52,8.34 6.71,4.53 U5.2
CS0  (via drill 0.3)
  Top 0.152: 43.05,19.77 43.2,19.62 44.27,19.62 45.64,20.99 49.53,20.99 49.84,21.29 51.21,21.29 52.58,22.66 J10.13 | 43.05,19.77 42.52,20.3 42.22,20.3 R9.2 | v21.64,7.27 21.49,7.42 20.19,7.42 U5.9 | v28.5,10.55 28.5,11.61 28.42,11.69 28.42,12.15 31.24,14.97 35.2,14.97 36.12,15.88 38.94,15.88 39.55,16.49 40.46,16.49 v41.6,17.63 | 43.05,19.77 v42.9,19.62
  Bottom 0.152: v21.64,7.27 21.95,7.27 22.71,8.03 23.16,8.03 23.39,7.8 25.76,7.8 v28.5,10.55 | v41.6,17.63 41.6,18.24 42.9,19.54 v42.9,19.62
D0RX8266  (via drill 0.3)
  Top 0.152: v46.41,7.2 47.78,8.57 49.53,8.57 U1.3 | 24.57,11.58 26.98,9.18 26.98,8.41 27.28,8.11 31.01,8.11 31.62,7.5 35.13,7.5 36.5,6.13 J3.1 | 24.57,11.58 24.54,11.61 23.93,11.61 23.24,12.3 14.86,12.3 6.71,20.45 U5.21 | v35.2,19.54 37.34,21.67 37.34,22.66 J10.7 | v30.71,15.65 30.4,15.65 v29.41,16.64 | v26.67,15.27 26.67,13.67 24.57,11.58
  Bottom 0.152: v46.41,7.2 46.41,6.89 45.03,5.52 45.03,4.45 43.13,2.55 42.52,2.55 J9.9 42.52,2.62 42.52,4.38 40.77,6.13 J3.1 | v35.2,19.54 34.06,19.54 32.23,17.71 32.16,17.71 31.47,17.03 31.47,16.42 v30.71,15.65 | v29.41,16.64 28.27,16.64 26.9,15.27 v26.67,15.27
D1TX8266  (via drill 0.3)
  Top 0.152: v48.39,9.18 49.53,9.18 U1.4 | v36.8,3.92 34.59,6.13 J3.2 | v5.18,19.01 4.72,19.46 4.72,20.45 U5.22 | v6.25,18.32 v15.01,9.56
  Bottom 0.152: v48.39,9.18 48.39,7.96 45.64,5.21 45.64,2.85 45.03,2.24 J9.10 44.96,2.17 43.74,0.95 39.55,0.95 38.71,1.79 38.71,2.85 37.64,3.92 v36.8,3.92 | v5.18,19.01 5.49,19.01 5.52,19.04 | 5.52,19.04 10.82,24.34 32.99,24.34 34.82,22.51 J10.6 | J3.2 34.29,6.13 33.07,4.91 25.68,4.91 25.45,5.14 18.29,5.14 15.01,8.41 v15.01,9.56 | 5.52,19.04 v6.25,18.32
D2IO9  (via drill 0.3)
  Top 0.152: v24.23,6.97 23.24,7.96 23.24,8.41 20.19,11.46 U5.11 | v43.59,10.93 43.59,9.02 v44.12,8.49 | v44.5,4.68 46.41,4.68 47.47,3.61 47.47,2.55 J9.11
  Bottom 0.152: v24.23,6.97 28.96,6.97 31.09,9.1 34.52,9.1 35.28,8.34 39.24,8.34 39.78,8.87 41.53,8.87 v43.59,10.93 | v44.12,8.49 44.12,5.06 v44.5,4.68
D3IO10  (via drill 0.3)
  Top 0.152: v21.64,13.44 20.19,13.44 U5.12 | v38.41,9.56 38.71,9.56 39.62,8.64 40.54,8.64 41.3,7.88 41.3,6.97 41.45,6.81 44.5,6.81 v44.96,7.27
  Bottom 0.152: v21.64,13.44 21.64,11.92 23.77,9.79 26.98,9.79 28.27,11.08 30.79,11.08 32.31,9.56 v38.41,9.56 | v44.96,7.27 47.4,9.71 48.62,9.71 48.92,9.41 48.92,8.03 45.95,5.06 45.95,3 46.33,2.62 46.33,2.01 47.09,1.25 49.15,1.25 50.06,2.17 J9.12
D4IO0  (via drill 0.3)
  Top 0.152: 16.57,16.61 12.72,20.45 U5.18 12.72,20.53 14.33,22.13 15.93,22.13 16.99,23.2 U4.2 | 16.57,16.61 16.61,16.57 21.26,16.57 21.41,16.72 21.41,18.85 22.17,19.62 R16.2 | v16.54,16.57 16.57,16.61 | v41.99,19.39 42.75,18.63 42.9,18.63 Q2.3 43.36,19.01 44.81,19.01 45.34,18.47 45.87,18.47 v46.71,17.63 | v47.7,4.38 47.93,4.15 49.84,4.15 51.44,2.55 52.58,2.55 J9.13
  Bottom 0.152: v16.54,16.57 13.34,13.37 13.34,7.58 10.44,4.68 10.44,2.32 SW2.1 | v41.99,19.39 42.37,19.77 42.37,19.84 43.28,20.76 43.43,20.76 43.74,21.06 43.74,23.12 42.9,23.96 39.62,23.96 38.56,22.89 38.56,22.21 36.73,20.38 31.17,20.38 31.01,20.23 24.99,20.23 23.7,21.52 18.75,21.52 17.07,23.2 U4.2 | v47.7,4.38 47.7,6.36 49.23,7.88 49.23,9.56 48.69,10.09 48.16,10.09 47.85,10.4 47.85,10.85 50.98,13.98 51.59,13.98 51.89,14.28 51.89,15.81 50.06,17.63 v46.71,17.63
D5IO2  (via drill 0.3)
  Top 0.152: v33.53,18.24 33.53,20.23 R19.1 | v34.9,18.78 34.9,19.08 34.67,19.31 v34.67,20.99 | v28.73,21.06 28.27,21.06 Q4.2 | v17.68,21.75 15.93,21.75 14.71,20.53 U5.17 | v23.93,20.53 27.66,20.53 Q4.2 | v36.58,10.09 38.63,8.03 38.63,7.35 39.62,6.36 44.88,6.36 45.03,6.2 51.05,6.2 51.44,5.82 51.44,4.6 51.89,4.15 52.65,4.15 54.56,2.24 55.09,2.24 J9.14 | v29.95,15.35 28.5,16.8 28.5,19.69 27.74,20.45 Q4.2
  Bottom 0.152: v33.53,18.24 33.83,18.24 34.37,18.78 v34.9,18.78 | v34.67,20.99 30.63,20.99 30.18,20.53 29.26,20.53 v28.73,21.06 | v17.68,21.75 18.06,21.75 19.28,20.53 v23.93,20.53 | v36.58,10.09 35.28,11.39 33.98,11.39 30.02,15.35 v29.95,15.35
D6IO16  (via drill 0.3)
  Top 0.152: v16.69,12.99 18.06,14.36 21.72,14.36 22.33,14.97 22.33,16.95 24.38,19.01 R18.1 24.38,18.93 24.69,18.63 v25.15,18.63 | v13.87,7.65 10.74,4.53 U5.4 | v43.2,21.29 47.78,21.29 48.77,22.28 48.77,22.89 49.84,23.96 53.03,23.96 54.48,22.51 55.09,22.51 J10.14
  Bottom 0.152: v16.69,12.99 13.87,10.17 v13.87,7.65 | v43.2,21.29 42.52,21.29 40.31,19.08 36.42,19.08 35.43,20.07 32.92,20.07 32.16,19.31 25.83,19.31 v25.15,18.63
DTR  (via drill 0.3)
  Top 0.152: v39.01,11.23 38.1,12.15 38.1,12.45 R8.1 | v41,11.23 41.68,10.55 42.29,10.55 U1.15 | v43.81,14.05 Q2.2
  Bottom 0.152: v39.01,11.23 v41,11.23 v43.81,14.05
EN
  Top 0.152: R12.2 13.41,2.62 13.18,2.62 12.57,3.23 9.98,3.23 8.76,4.45 U5.3
GND  (via drill 0.3)
  Top 0.305: C8.1 44.5,5.6 47.4,5.6 48.23,4.76 48.92,4.76 R5.1 49.07,4.68 50.29,4.68 50.67,5.06 C7.1 50.52,4.76 v51.51,3.77 | 55.7,4.6 C12.1 56.24,4.53 v56.24,3.77 | 55.7,4.6 C9.1 | 55.7,4.6 55.7,5.6 U3.1 55.55,5.67 55.17,5.67 54.94,5.9 54.94,6.28 U3.9 | U3.9 54.86,6.43 54.63,6.66 54.1,6.66 U3.6 53.95,6.66 53.49,6.66 53.26,6.89 C3.2 | U3.3 55.63,6.66 55.09,6.66 54.94,6.51 U3.9 | J1.S6 63.93,15.65 64.47,16.19 64.47,17.03 C5.- 64.54,17.18 66.75,19.39 66.75,21.44 J2.2 | J1.5 63.7,13.6 63.4,13.9 63.4,15.04 63.86,15.5 J1.S6 | J1.S2 66.67,10.78 66.98,11.08 J1.S3 67.06,11.23 67.06,13.22 J1.S4 66.98,13.37 66.67,13.67 J1.S5 66.6,15.58 66.06,16.11 64.54,16.11 J1.S6 | U2.1 60.05,13.52 59.36,13.52 58.67,14.21 U2.HEAT | U2.3 60.05,14.51 59.59,14.51 59.05,13.98 U2.HEAT | C13.2 51.82,17.86 53.34,17.86 R6.1 53.42,17.71 53.42,17.18 53.87,16.72 53.87,14.51 | 51.13,9.63 51.13,8.57 51.28,8.41 C10.2 | 51.13,9.63 51.13,10.17 C1.1 | J1.S1 63.86,8.87 63.4,9.33 62.18,9.33 59.59,11.92 59.44,11.92 R1.1 59.36,11.84 58.67,11.16 57.45,11.16 57.38,11.23 57.15,11.23 | 51.13,9.63 52.88,9.63 54.48,11.23 | 57.15,11.23 54.48,11.23 | C11.1 60.35,5.67 61.34,5.67 63.86,8.19 63.86,8.72 J1.S1 | 53.87,14.51 53.87,11.84 54.48,11.23 | 57.15,11.23 57.15,12.53 57.38,12.76 57.53,12.76 58.75,13.98 U2.HEAT | J1.S2 66.6,8.95 64.01,8.95 J1.S1 | J6.- 66.52,6.36 66.52,8.87 J1.S2 | 48.62,13.6 48.54,13.52 48.54,12.07 48.77,11.84 49.53,11.84 U1.8 | 48.62,13.6 49,13.98 C2.1 | 48.27,13.94 46.86,15.35 46.86,15.96 C6.- 46.79,16.03 46.02,16.8 C4.2 45.11,16.87 44.35,17.63 v43.74,17.63 | 48.27,13.94 48.62,13.6 | C14.1 18.06,2.24 16.54,2.24 C15.1 16.38,2.24 15.01,0.87 6.86,0.87 5.41,2.32 SW2.2
  Top 0.305: 32,20.3 31.93,20.3 29.79,22.44 J10.4 | 32,20.3 32.61,20.3 R19.2 | SW1.2 10.44,22.66 11.35,22.66 11.89,23.2 U4.4 | R15.1 27.58,5.37 29.72,5.37 30.48,6.13 J3.4 | v18.67,19.01 18.67,20.45 U5.15 | v31.32,8.57 31.32,8.87 30.86,9.33 30.86,9.94 31.47,10.55 v32.54,10.55 | v32,18.24 32,20.3 | v30.71,12.53 32.61,14.43 35.28,14.43 35.97,15.12 39.78,15.12 JP1.5 | v51.36,14.51 53.87,14.51 | v48.31,13.98 48.27,13.94
  Bottom 0.305: J6.- 66.45,6.28 65.46,5.29 58.6,5.29 57.07,3.77 v56.24,3.77 v51.51,3.77 | v43.74,17.63 41.3,15.2 39.85,15.2 JP1.5 | 27.28,14.66 24.23,14.66 J5.4 24.08,14.74 23.16,15.65 21.49,15.65 18.67,18.47 v18.67,19.01 18.59,19.08 16.46,19.08 12.34,23.2 11.96,23.2 U4.4 | 27.28,14.66 28.35,14.66 30.48,16.8 J4.4 30.63,16.87 v32,18.24 | v31.32,8.57 30.56,7.8 30.56,6.13 J3.4 | v32.54,10.55 32.38,10.55 30.56,12.38 | 30.56,12.38 29.49,13.44 27.58,13.44 27.28,13.75 27.28,14.66 | SW2.2 5.41,2.32 5.41,16.57 10.36,21.52 10.36,22.59 SW1.2 | v30.71,12.53 30.56,12.38 | v51.36,14.51 49.07,14.51 48.54,13.98 v48.31,13.98
LIPO_BAT  (via drill 0.3)
  Top 0.305: R2.2 59.97,9.94 61.72,8.19 J8.1 | v56.39,12.53 56.84,12.99 56.84,13.06 57.23,13.44 U2.8 | U2.5 57.23,15.04 57.23,17.94 56.62,18.55 56.62,20.15 56.01,20.76 49.91,20.76 48.77,19.62 J7.2
  Bottom 0.305: J6.+ 64.47,6.36 63.48,6.36 61.72,8.11 J8.1 61.8,8.26 61.8,9.33 63.02,10.55 63.02,13.75 62.48,14.28 59.74,14.28 55.47,10.01 54.48,10.01 54.18,10.32 54.18,12.91 54.79,13.52 | 56.39,13.44 v56.39,12.53 | 56.39,13.44 58.67,15.73 BAT-LUX.3 | 54.79,13.52 56.31,13.52 56.39,13.44 | 54.79,13.52 48.77,19.54 J7.2
LIPOVIN  (via drill 0.3)
  Top 0.152: 54.1,5.14 54.1,5.6 U3.8 54.03,5.67 54.03,6.13 U3.7 | 54.1,5.14 54.1,4.6 C9.2 | U3.5 54.03,7.2 53.72,7.2 53.34,7.58 52.35,7.58 52.12,7.35 52.12,5.44 C7.2 52.5,5.14 53.42,5.14 | 53.42,5.14 54.1,5.14 | v53.42,4.99 53.42,5.14
  Bottom 0.152: v53.42,4.99 56.77,4.99 59.13,7.35 59.13,8.11 J8.2
LUX
  Top 0.152: C13.1 51.82,19.39 53.34,19.39 R6.2 53.34,19.31 55.4,19.31 Q1.E
  Bottom 0.152: Q1.E BAT-LUX.1
MISO  (via drill 0.3)
  Top 0.152: v22.94,7.5 21.03,9.41 20.19,9.41 U5.10 | v30.25,10.17 30.48,10.17 31.39,11.08 33.6,11.08 34.06,10.62 34.06,10.32 v35.51,8.87 | v44.58,18.47 44.88,18.47 45.8,17.56 v45.95,17.56
  Bottom 0.152: v22.94,7.5 27.58,7.5 v30.25,10.17 | v35.51,8.87 38.63,8.87 39.78,10.01 JP1.3 39.85,10.09 40.62,10.09 45.95,15.42 v45.95,17.56 | v44.58,18.47 44.96,18.85 44.96,22.44 J10.10
MOSI  (via drill 0.3)
  Top 0.152: v18.67,14.89 19.2,15.42 20.12,15.42 U5.13 | v17.14,8.87 v18.67,10.4 | v50.06,19.84 50.06,19.31 v47.85,17.1
  Bottom 0.152: v18.67,10.4 v18.67,14.89 | v17.14,8.87 17.14,6.74 18.44,5.44 29.95,5.44 30.18,5.21 32.92,5.21 33.6,5.9 33.6,6.51 34.59,7.5 40.01,7.5 JP1.2 40.08,7.58 41,7.58 44.12,10.7 44.12,11.31 47.85,15.04 v47.85,17.1 | v50.06,19.84 50.06,22.44 J10.12
N$1
  Top 0.152: R10.2 27.66,8.95 27.66,13.06 28.42,13.82 28.42,16.42 27.74,17.1 27.74,18.7 Q4.1
N$2
  Top 0.152: D3.+ 54.63,13.52 54.63,14.97 D4.+ 54.86,15.27 R3.1
N$3
  Top 0.152: L1.1 56.39,7.65 56.39,6.43 56.16,6.2 55.7,6.2 U3.2
N$4  (via drill 0.3)
  Top 0.152: v48.31,5.6 49,5.6 R5.2 | v54.86,7.58 55.24,7.58 55.63,7.2 U3.4 | v56.62,5.6 57.15,6.13 R4.1
  Bottom 0.152: v48.31,5.6 52.88,5.6 v54.86,7.58 54.79,7.42 v56.62,5.6
N$5
  Top 0.305: C1.2 52.05,10.24 52.05,11.31 Y1.2 51.97,11.39 50.9,12.45 49.61,12.45 U1.9
N$6
  Top 0.305: U1.10 49.61,13.14 49.99,13.52 49.99,13.98 C2.2 50.06,14.13 51.82,15.88 52.27,15.88 Y1.1
N$7
  Top 0.152: U2.2 60.12,13.98 60.5,13.98 60.73,13.75 60.73,13.29 60.12,12.68 58.6,12.68 57.91,12 R1.2
N$8
  Top 0.152: D3.- 56.62,13.98 57.23,13.98 U2.7
N$9  (via drill 0.3)
  Top 0.152: v50.83,11.16 U1.7 | v62.41,10.85 62.64,11.08 62.64,11.16 63.02,11.54 63.7,11.54 J1.2
  Bottom 0.152: v50.83,11.16 52.65,11.16 54.18,9.63 57.53,9.63 61.8,13.9 62.26,13.9 62.56,13.6 62.56,11.01 v62.41,10.85
N$10
  Top 0.152: R2.1 54.94,9.25 54.94,8.41 54.18,7.65 53.72,7.65 53.49,7.88 53.42,7.88 52.88,8.41 C10.1
N$11  (via drill 0.3)
  Top 0.152: v48.39,10.62 48.46,10.55 49.53,10.55 U1.6 | v62.03,13.37 63.17,12.22 J1.3
  Bottom 0.152: v48.39,10.62 50.44,10.62 51.74,9.33 57.99,9.33 v62.03,13.37
N$12
  Top 0.152: U2.6 57.23,14.51 56.62,14.51 56.16,14.97 D4.-
N$13  (via drill 0.3)
  Top 0.152: v46.94,8.49 46.94,9.86 43.05,13.75 43.05,16.95 41.45,18.55 41.45,20.84 41.68,21.06 42.67,21.06 43.36,20.38 43.66,20.38 R9.1
  Bottom 0.152: v46.94,8.49 46.94,6.97 45.34,5.37 45.34,4.3 43.66,2.62 43.66,2.01 42.9,1.25 41.99,1.25 41.22,2.01 41.22,3.16 41.68,3.61 41.68,4.07 40.84,4.91 39.85,4.91 JP1.1
N$14
  Top 0.152: R8.2 37.11,12.53 36.65,12.99 36.12,12.99 35.36,12.22 35.36,11.84 Q3.1
N$15
  Top 0.152: R7.2 41.91,16.42 Q2.1
N$20  (via drill 0.3)
  Top 0.152: v29.03,18.78 29.03,20.3 R11.1 | v26.59,18.78 26.44,18.78 25.68,19.54 Q4.3
  Bottom 0.152: v26.59,18.78 v29.03,18.78
RST  (via drill 0.3)
  Top 0.152: 26.78,15.92 27.89,14.82 v27.89,14.05 | 26.78,15.92 24.92,17.79 24.38,17.79 R18.2 | v31.85,12.76 33.22,12.76 Q3.3 | v29.95,21.06 30.18,20.84 30.25,20.84 31.39,19.69 v31.39,18.78 | 26.78,15.92 v26.9,16.03 | v15.7,3.08 15.7,3 15.01,2.32 C15.2 | v12.72,2.32 12.19,2.32 12.04,2.47 R13.2 11.96,2.47 11.81,2.47 10.74,1.4 7.77,1.4 4.72,4.45 U5.1 4.72,4.53 5.71,5.52 5.71,21.44 5.41,21.75 5.41,22.59 SW1.1 5.49,22.59 7.24,24.34 12.34,24.34 12.88,23.81 v13.18,23.81
  Bottom 0.152: v27.89,14.05 30.56,14.05 v31.85,12.76 | v29.95,21.06 30.02,21.06 31.62,22.66 32.23,22.66 J10.5 | v31.39,18.78 29.79,18.78 27.05,16.03 v26.9,16.03 25.6,16.03 21.41,20.23 15.93,20.23 13.18,22.97 v13.18,23.81 | v15.7,3.08 14.86,3.08 14.4,3.54 13.95,3.54 v12.72,2.32
RTS
  Top 0.152: 38.86,13.75 35.43,13.75 Q3.2 | 38.86,13.75 40.01,13.75 40.54,14.28 41.91,14.28 R7.1 | 38.86,13.75 38.86,12.15 39.55,11.46 40.01,11.46 41.53,9.94 42.29,9.94 U1.16
SCLK
  Top 0.152: U5.14 20.12,17.48 20.12,20.99 18.97,22.13 18.59,22.13 18.44,22.28 18.44,24.11 18.67,24.34 45.87,24.34 47.47,22.74 J10.11
  Bottom 0.152: JP1.4 40.08,12.61 40.23,12.61 46.1,18.47 47.09,18.47 47.47,18.85 47.47,22.66 J10.11
SOLAR
  Top 0.305: D1.+ 60.2,19.77 61.57,19.77 63.25,21.44 J2.1
SOLUSB  (via drill 0.3)
  Top 0.305: 60.12,15.42 60.12,16.34 D1.- 60.12,16.49 60.12,17.18 58.22,19.08 Q1.C | 60.12,15.42 60.12,15.04 U2.4 | C5.+ 61.95,17.03 61.95,15.88 D2.- 61.34,15.42 60.12,15.42 | R3.2 56.39,17.33 v56.62,17.56 | v41.99,5.82 42.14,5.67 42.9,5.67 C8.2 | U1.19 42.37,7.88 43.13,7.88 v43.59,7.42 44.04,7.88 45.26,7.88 45.57,7.58 45.57,7.12 46.1,6.59 50.37,6.59 50.67,6.89 C3.1 | v48.39,14.74 49.68,16.03 C6.+ 49.84,16.11 50.9,17.18 v50.9,18.32
  Bottom 0.305: v56.62,17.56 58.14,19.08 Q1.C 57.84,18.93 56.01,20.76 53.34,20.76 v50.9,18.32 | v41.99,5.82 v43.59,7.42 43.51,7.5 43.51,8.8 44.5,9.79 44.5,11.08 48.16,14.74 v48.39,14.74
USB5V
  Top 0.305: D2.+ 61.49,12.07 61.49,10.78 62.1,10.17 63.02,10.17 63.7,10.85 J1.1
V3
  Top 0.152: C4.1 45.26,15.27 45.26,12.99 48.31,9.94 49.53,9.94 U1.5
VIN  (via drill 0.3)
  Top 0.305: v34.29,17.94 34.29,20.45 33.3,21.44 31.77,21.44 31.01,22.21 31.01,22.97 30.25,23.73 29.18,23.73 28.5,23.04 28.5,22.21 27.74,21.44 25.68,21.44 24.69,22.44 J10.2
  Bottom 0.305: v34.29,17.94 33.53,17.18 33.53,14.36 36.04,11.84 36.65,11.84 38.63,13.82 40.84,13.82 46.18,19.16 46.18,19.54 J7.1

### Text on the board
tPlace: Sol | I2C | Vin | LIPO | + | MK12.1 | TxRx | 3V3 | A0A6 | + | LiPo
bPlace: SDA | 3V3 | Gnd | c MK12.Tracker99.com | SCLK | MISO | MOSI | CS
test-probe: 5V | VIN(5V) | VCC | GND | RESET | 14 | 13 | 12 | 11 | 10 | 9 | 8 | 7 | 6 | USB_5V | USB_D- | SWCLK | SWDIO | JGND | JRST | VTG | BATT+ | BATT- | USB_D+ | USB_GND | AREF | A0 | A1 | A2 | A3 | A4 | A5 | A6 | 0 | 1 | 2 | 3 | 4 | 5